# Altium schematic sheet Final PCB.SchDoc
size A
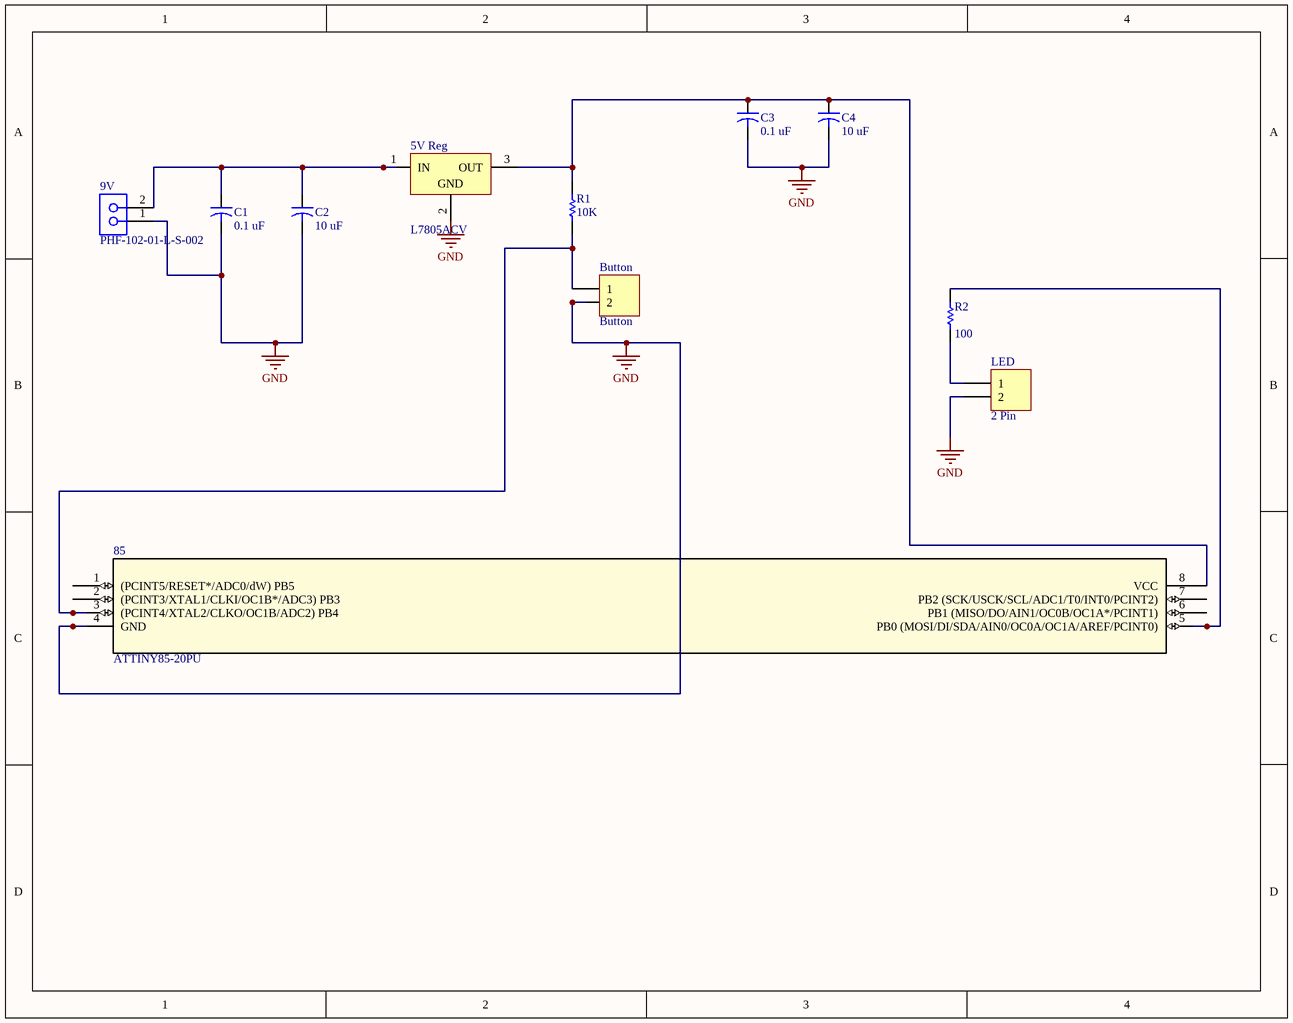
[diagram p0: Final PCB.SchDoc]

## Parts
5V_Reg  L7805ACV  [TO220]
9V  PHF-102-01-L-S-002  [SMTC-PHF-102-01-X-S-002]
85  ATTINY85-20PU  [8P3]
Button  Button  [HDR1X2]
C1  value 0.1 uF  [CAPR5-4X5]  (hidden comment: Cap2)
C2  value 10 uF  [CAPR5-4X5]  (hidden comment: Cap2)
C3  value 0.1 uF  [CAPR5-4X5]  (hidden comment: Cap2)
C4  value 10 uF  [CAPR5-4X5]  (hidden comment: Cap2)
LED  2 Pin  [HDR1X2]
R1  10K  [AXIAL-0.3]
R2  100  [AXIAL-0.3]

## Nets
GND: 5V_Reg.2(GND) 9V.1 85.4(GND) Button.2 C1.2 C2.2 C3.2 C4.2 LED.2
Net5V_Reg_1: 5V_Reg.1(IN) 9V.2 C1.1 C2.1
Net5V_Reg_3: 5V_Reg.3(OUT) 85.8(VCC) C3.1 C4.1 R1.2
Net85_3: 85.3((PCINT4/XTAL2/CLKO/OC1B/ADC2)_PB4) Button.1 R1.1
Net85_5: 85.5(PB0_(MOSI/DI/SDA/AIN0/OC0A/OC1A/AREF/PCINT0)) R2.2
NetLED_1: LED.1 R2.1

Not connected (* = marked no-connect by the designer): 85 1((PCINT5/RESET*/ADC0/dW)_PB5) 2((PCINT3/XTAL1/CLKI/OC1B*/ADC3)_PB3) 6(PB1_(MISO/DO/AIN1/OC0B/OC1A*/PCINT1)) 7(PB2_(SCK/USCK/SCL/ADC1/T0/INT0/PCINT2))

## Library data of the parts
5V_Reg = CMP-0244-00484-1: Positive Voltage Regulator, 5V, 3-Pin TO-220; DatasheetVersion: 16/11/2011; ComponentLink2Description: Datasheet; ComponentLink3Description: Package Specification; ComponentLink2URL: http://www.st.com/internet/com/TECHNICAL_RESOURCES/TECHNICAL_LITERATURE/DATASHEET/CD00000444.pdf; PackageDescription: TO, Thru-Hole, Vertical, Heatsink Mounted; 3 In-Line Leads; Pitch 2.54 mm; ComponentLink3URL: http://www.st.com/internet/com/TECHNICAL_RESOURCES/TECHNICAL_LITERATURE/PACKAGE_INFORMATION/CD00004649.pdf; PackageReference: TO220; ComponentLink1URL: http://www.st.com; PackageVersion: ver3.0; ComponentLink1Description: Manufacturer URL
9V = CMP-1023-00103-1: Press Fit Socket, Through-hole, Vertical, -55 to 125 degC, 2.54 mm Pitch, 2-Pin, Female, RoHS; Manufacturer: Samtec; Pitch: 2.54 mm; Temperature Range: -55 to 125 degC; PackageDescription: .100 Press Fit Socket Assembly; ComponentLink1URL: http://www.samtec.com; ComponentLink1Description: Manufacturer URL; PackageReference: PHF-102-01-X-S-002; Orientation: Vertical; ComponentLink2URL: http://www.samtec.com/documents/webfiles/pdf/phf.pdf; ComponentLink3Description: Package Specification; RoHS: True; DatasheetVersion: F-214; PartNumber: PHF-102-01-L-S-002; ComponentLink2Description: Datasheet; PackageVersion: F, 9/2009; ComponentLink3URL: http://www.samtec.com/documents/webfiles/cpdf/PHF-1XX-XX-X-X-XXX-MKT.pdf; Mounting Technology: Through-hole
85 = ATTINY85-20PU: Imported; Vendor: Atmel; Built_By: EMA_UL_Team; C: Copyright (C) 2015 Accelerated Designs. All rights reserved; Manufacturer_Part_Number: ATTINY85-20PU; RefDes: RefDes; Type: DEV; Value: Value
Button LED = Header 2: Header, 2-Pin; LatestRevisionDate: 17-Jul-2002; LatestRevisionNote: Re-released for DXP Platform.; Publisher: Altium Limited
C1-C4 = Cap2: Capacitor; Published: 23-Sep-2002; PackageReference: CAPR5-4X5; Publisher: Altium Limited; PackageDescription: Capacitor; 2 Leads
R1 R2 = Res1: Resistor; Published: 8-Jun-2000; LatestRevisionDate: 17-Jul-2002; LatestRevisionNote: Re-released for DXP Platform.; PackageReference: AXIAL-0.3; Publisher: Altium Limited; PackageDescription: Axial Device, Thru-Hole; 2 Leads; 0.3 in Pin Spacing
  R1: Value: 10K
  R2: Value: 100